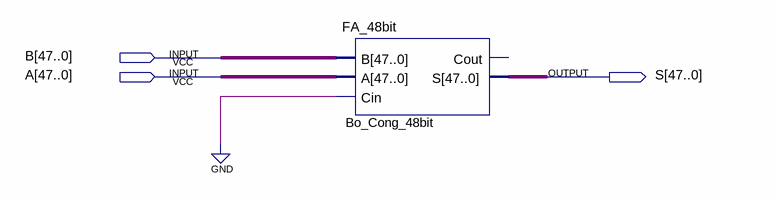
[diagram p0: schematic sheet]
// Quartus schematic BoCong_48bit.bdf as structural Verilog: 1 symbols, 3 pins
module BoCong_48bit (
  input  [47:0] B,
  input  [47:0] A,
  output [47:0] S
);

  FA_48bit Bo_Cong_48bit (.B(B), .A(A), .Cin(1'b0), .S(S));  // open: Cout
endmodule
